# Altium schematic sheet Deneigus_Controle_Soufflante.SchDoc
size Tabloid; Date: Date; Author: Author 1; Revision: 1; Size: 11x17; Sheet_Name: Interface Soufflante
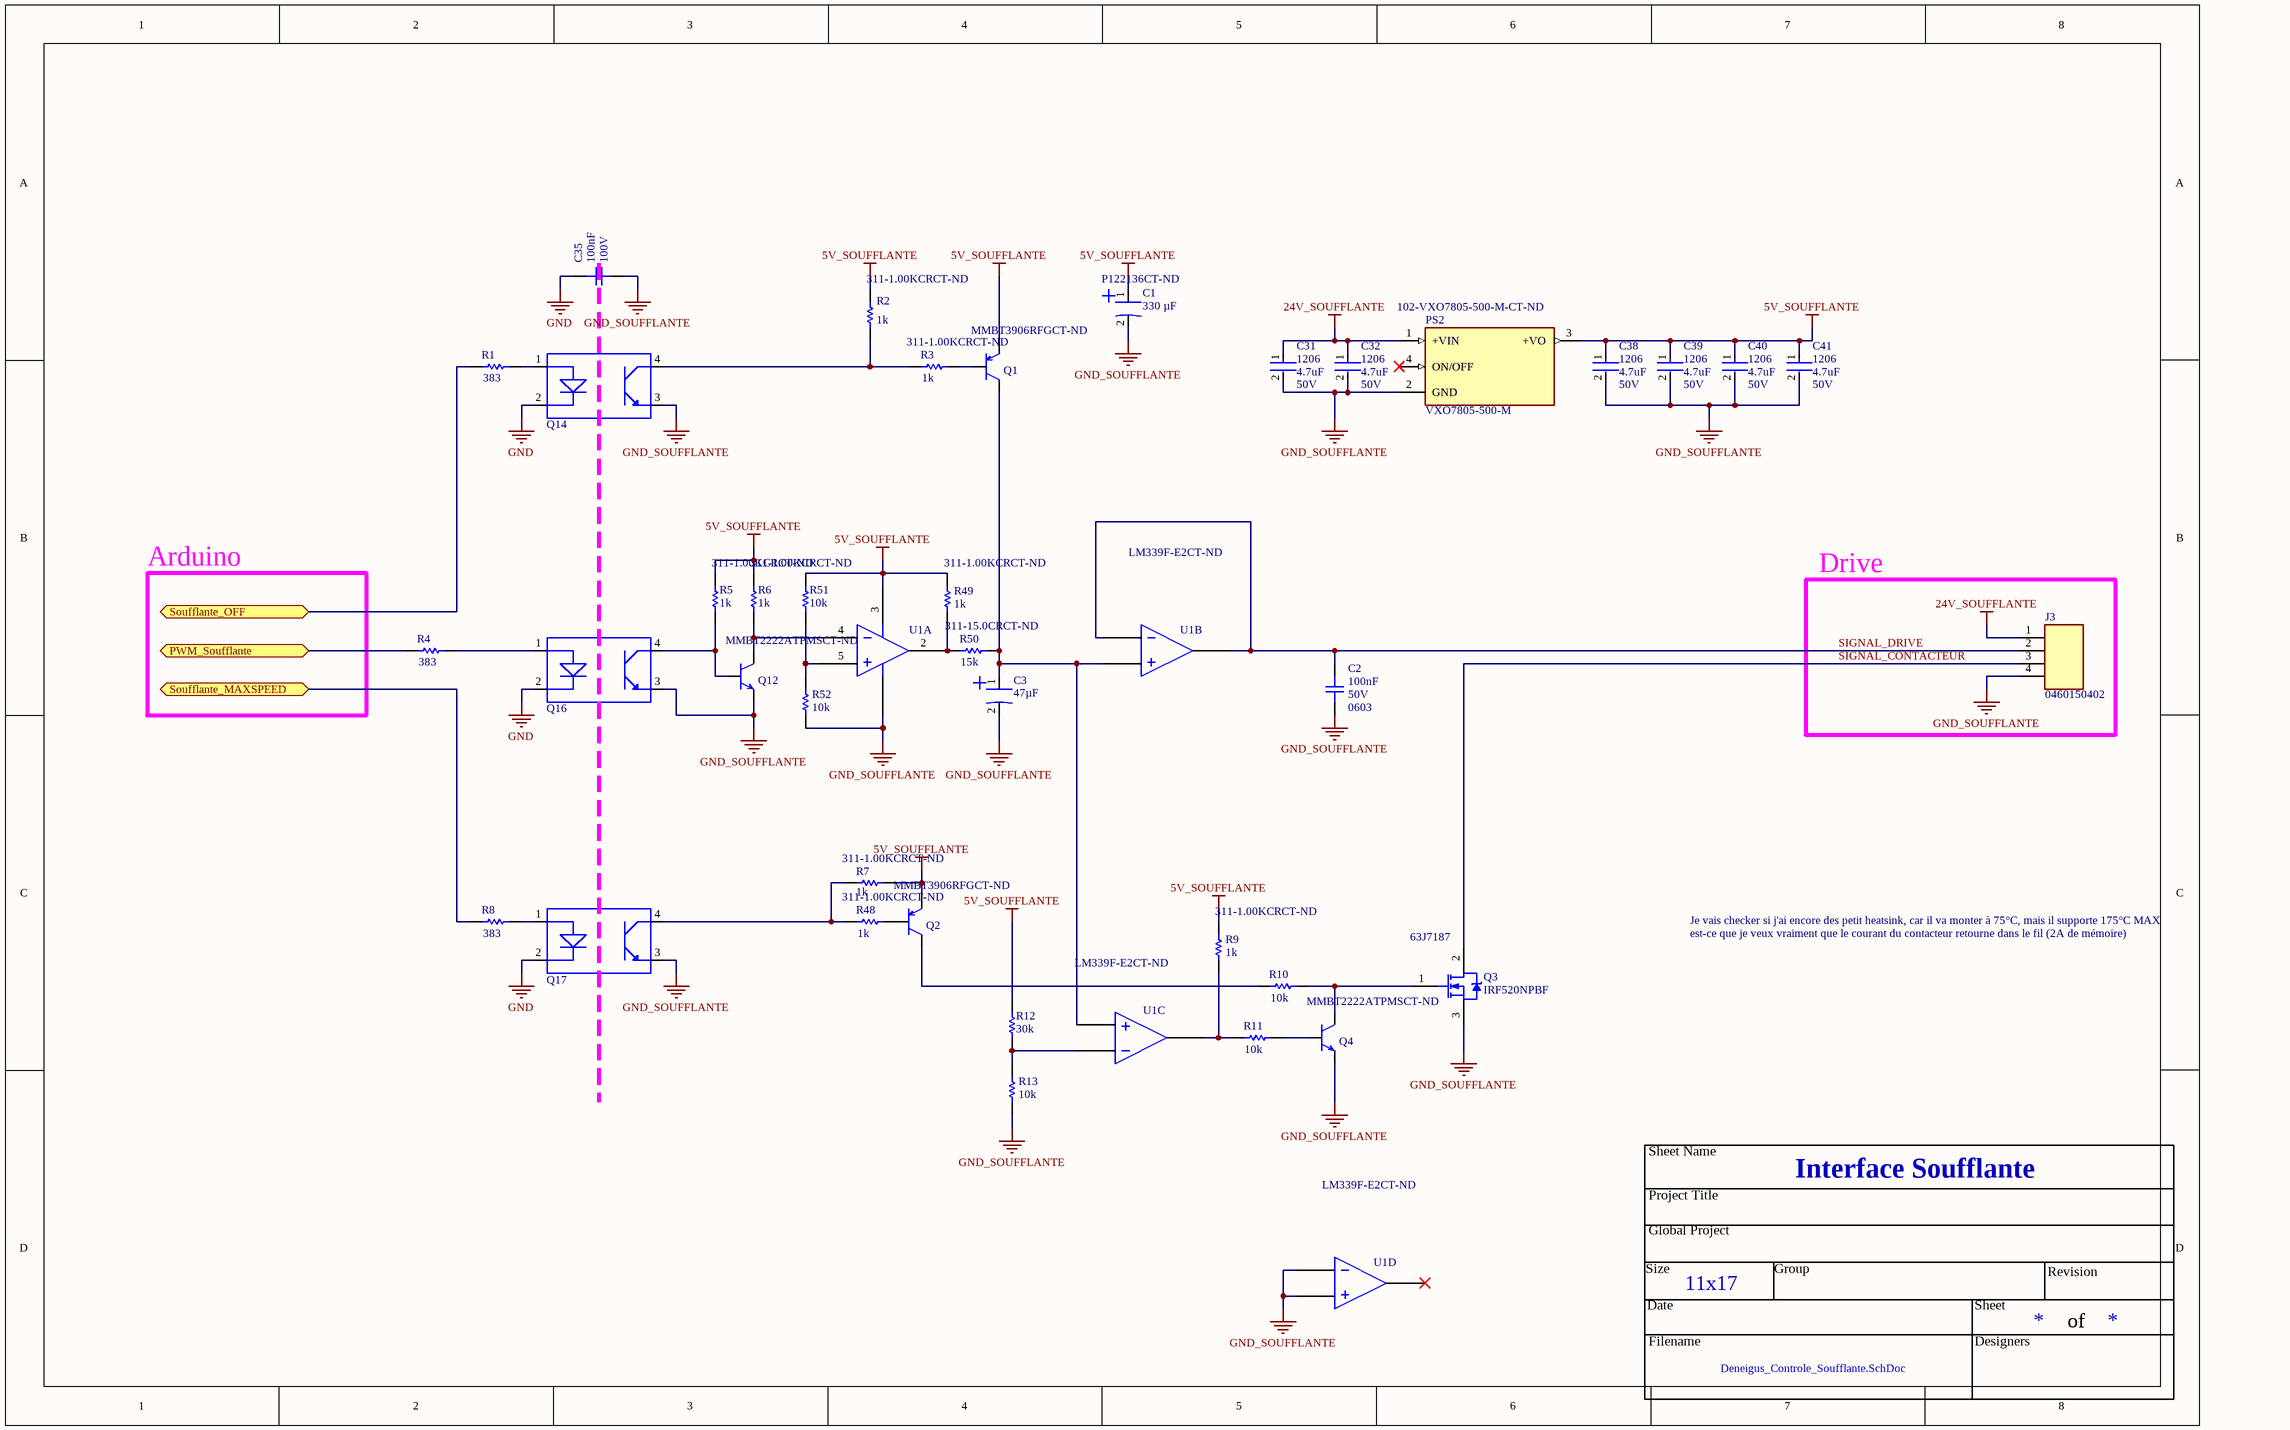
[diagram p0: Deneigus_Controle_Soufflante.SchDoc]

## Parts
C1  value 330 µF  Supplier Part Number 1: P122136CT-ND  [330uF (10.3x10.3mm)]  (hidden comment: CAP ALUM POLY 47UF 20% 16V SMD)
C2  value 100nF  Voltage: 50V  Package: 0603  [CAP_0603]  (hidden comment: CAP - 0603)
C3  value 47µF  [47uF]  (hidden comment: CAP ALUM POLY 47UF 20% 16V SMD)
C31  Case/Package: 1206  Voltage Rating: 50V  Capacitance: 4.7uF  [FP-CL31-IPC_C]  (hidden comment: CL31B475KBHNFNE)
C32  Case/Package: 1206  Voltage Rating: 50V  Capacitance: 4.7uF  [FP-CL31-IPC_C]  (hidden comment: CL31B475KBHNFNE)
C35  value 100nF  Voltage: 100V  [CAP_0805]  (hidden comment: CAP - 0805)
C38  Case/Package: 1206  Voltage Rating: 50V  Capacitance: 4.7uF  [FP-CL31-IPC_C]  (hidden comment: CL31B475KBHNFNE)
C39  Case/Package: 1206  Voltage Rating: 50V  Capacitance: 4.7uF  [FP-CL31-IPC_C]  (hidden comment: CL31B475KBHNFNE)
C40  Case/Package: 1206  Voltage Rating: 50V  Capacitance: 4.7uF  [FP-CL31-IPC_C]  (hidden comment: CL31B475KBHNFNE)
C41  Case/Package: 1206  Voltage Rating: 50V  Capacitance: 4.7uF  [FP-CL31-IPC_C]  (hidden comment: CL31B475KBHNFNE)
J3  0460150402  [Molex_4PIN]
PS2  VXO7805-500-M  Supplier Part Number 1: 102-VXO7805-500-M-CT-ND  [CONV_VXO7805-500-M]
Q1  Supplier Part Number 1: MMBT3906RFGCT-ND  [SOT-23]  (hidden comment: TRANS PNP 40V 0.2A SOT23)
Q2  Supplier Part Number 1: MMBT3906RFGCT-ND  [SOT-23]  (hidden comment: TRANS PNP 40V 0.2A SOT23)
Q3  IRF520NPBF  Supplier Part Number 1: 63J7187  [INTR-TO-220AB-3]
Q4  Supplier Part Number 1: MMBT2222ATPMSCT-ND  [SOT-23]  (hidden comment: TRANS NPN 40V 0.2A SOT23)
Q12  Supplier Part Number 1: MMBT2222ATPMSCT-ND  [SOT-23]  (hidden comment: TRANS NPN 40V 0.2A SOT23)
Q14  WL-OCPT OPTOCOUPLER PHOTOTRANSIS  [WL-OCPT OPTOCOUPLER PHOTOTRANSIS]  (value not drawn)
Q16  WL-OCPT OPTOCOUPLER PHOTOTRANSIS  [WL-OCPT OPTOCOUPLER PHOTOTRANSIS]  (value not drawn)
Q17  WL-OCPT OPTOCOUPLER PHOTOTRANSIS  [WL-OCPT OPTOCOUPLER PHOTOTRANSIS]  (value not drawn)
R1  value 383  [RES_0805]  (hidden comment: Res1)
R2  value 1k  Supplier Part Number 1: 311-1.00KCRCT-ND  [RES_0805]  (hidden comment: Res1)
R3  value 1k  Supplier Part Number 1: 311-1.00KCRCT-ND  [RES_0805]  (hidden comment: Res1)
R4  value 383  [RES_0805]  (hidden comment: Res1)
R5  value 1k  Supplier Part Number 1: 311-1.00KCRCT-ND  [RES_0805]  (hidden comment: Res1)
R6  value 1k  Supplier Part Number 1: 311-1.00KCRCT-ND  [RES_0805]  (hidden comment: Res1)
R7  value 1k  Supplier Part Number 1: 311-1.00KCRCT-ND  [RES_0805]  (hidden comment: Res1)
R8  value 383  [RES_0805]  (hidden comment: Res1)
R9  value 1k  Supplier Part Number 1: 311-1.00KCRCT-ND  [RES_0805]  (hidden comment: Res1)
R10  value 10k  [RES_0805]  (hidden comment: Res1)
R11  value 10k  [RES_0805]  (hidden comment: Res1)
R12  value 30k  [RES_0805]  (hidden comment: Res1)
R13  value 10k  [RES_0805]  (hidden comment: Res1)
R48  value 1k  Supplier Part Number 1: 311-1.00KCRCT-ND  [RES_0805]  (hidden comment: Res1)
R49  value 1k  Supplier Part Number 1: 311-1.00KCRCT-ND  [RES_0805]  (hidden comment: Res1)
R50  value 15k  Supplier Part Number 1: 311-15.0CRCT-ND  [RES_0805]  (hidden comment: Res1)
R51  value 10k  [RES_0805]  (hidden comment: Res1)
R52  value 10k  [RES_0805]  (hidden comment: Res1)
U1  LM339  [SOP14]  (value not drawn)  (parts A,B,C,D of 4)

## Blocks framed on the sheet
Drive: J3

## Ports
PWM_Soufflante (bidir), Soufflante_MAXSPEED (bidir), Soufflante_OFF (bidir)

## Nets
5V_SOUFFLANTE: C1.1 C38.1 C39.1 C40.1 C41.1 PS2.3(+VO) Q1.2 Q2.2 R2.1 R5.2 R6.2 R7.1 R9.2 R12.2 R49.1 R51.2 U1.3
24V_SOUFFLANTE: C31.1 C32.1 J3.1 PS2.1(+VIN)
GND: C35.2 Q14.2 Q16.2 Q17.2
GND_SOUFFLANTE: C1.2 C2.1 C3.2 C31.2 C32.2 C35.1 C38.2 C39.2 C40.2 C41.2 J3.4 PS2.2(GND) Q3.3(S) Q4.2 Q12.2 Q14.3 Q16.3 Q17.3 R13.1 R52.1 U1.10 U1.11 U1.12
PWM_Soufflante: R4.1 ; port PWM_Soufflante
SIGNAL_CONTACTEUR: J3.3 Q3.2(D)
SIGNAL_DRIVE: C2.2 J3.2 U1.1 U1.6
Soufflante_MAXSPEED: R8.1 ; port Soufflante_MAXSPEED
Soufflante_OFF: R1.1 ; port Soufflante_OFF
NetC3_1: C3.1 Q1.3 R50.2 U1.7 U1.9
NetQ1_1: Q1.1 R3.2
NetQ2_1: Q2.1 R48.2
NetQ2_3: Q2.3 R10.2
NetQ3_1: Q3.1(G) Q4.3 R10.1
NetQ4_1: Q4.1 R11.2
NetQ12_1: Q12.1 Q16.4 R5.1
NetQ12_3: Q12.3 R6.1 U1.4
NetQ14_1: Q14.1 R1.2
NetQ14_4: Q14.4 R2.2 R3.1
NetQ16_1: Q16.1 R4.2
NetQ17_1: Q17.1 R8.2
NetQ17_4: Q17.4 R7.2 R48.1
NetR9_1: R9.1 R11.1 U1.14
NetR12_1: R12.1 R13.2 U1.8
NetR49_2: R49.2 R50.1 U1.2
NetR51_1: R51.1 R52.2 U1.5

Not connected (* = marked no-connect by the designer): PS2 4(ON/OFF)*; U1 13*

## Notes on the sheet
- Arduino
- Je vais checker si j'ai encore des petit heatsink, car il va monter à 75°C, mais il supporte 175°C MAX
- est-ce que je veux vraiment que le courant du contacteur retourne dans le fil (2A de mémoire)
- Sheet Name
- Project Title
- Global Project
- Revision
- Size
- Date
- Group
- Sheet
- of
- Filename
- Designers

## Library data of the parts
C1 C3 = 47µF SMD: Mfg Part Number: 875105344006; Mfg: Würth Elektronik; HelpURL: https://www.we-online.de/katalog/datasheet/875105344006.pdf
  C1: Supplier 1: Digi-Key
  C3: Supplier 1: Digikey; Supplier Part Number 1: 732-6421-2-ND
C2 = CAP - 0603: Precision: 10%; Current: *; CreatedBy: Jonathan Bouchard; Power: *
C31 C32 C38-C41 = CMP-13271-001123-1: Cap Ceramic 4.7uF 50V X7R ±10% SMD 1206 +125°C Embossed T/R; Depth: 1.6mm; Max Operating Temperature: 125°C; Case Code (Metric): 3216; Packaging: Tape and Reel; Mount: Surface Mount; Min Operating Temperature: -55°C; Thickness: 0.071inch; Length: 3.2mm; Dielectric: X7R; Case Code (Imperial): 1206; Height: 1.6mm; Package Quantity: 1; Tolerance: 10%; Radiation Hardening: No; Width: 0.063inch
C35 = CAP - 0805: Mfg Part Number: GRM21BR61H106ME43L; Mfg: Murata Electronics; Precision: 10%; Current: *; CreatedBy: Jonathan Bouchard; Power: *; Package: 0805; Supplier 1: Digi-Key; Supplier Part Number 1: 490-5825-1-ND
J3 = Molex_4PIN: Supplier 1: Digi-Key; Supplier Part Number 1: WM3844-ND
PS2 = VXO7805-500-M: 500 mA Output Current, 4.75~36 Vdc Input, SMT, Non-Isolated, Dc-Dc Converter; MF: CUI Inc.; Value: *; Price: None; MP: VXO7805-500-M; SnapEDA_Link: https://www.snapeda.com/parts/VXO7805-500-M/CUI%20Inc./view-part/4703817/?ref=snap; Package: SMD-4; Availability: Unavailable; Supplier 1: Digi-Key
Q1 Q2 = PNP 3906 SMD: Trans GP BJT PNP 40V 0.2A 3-Pin SOT-23 T/R; Manufacturer: MCC; Manufacturer Part Number: MMBT3906-TP; Number of Elements: 1; hFE Min: 60; Max Power Dissipation: 300mW; Frequency: 250MHz; Max Collector Current: 200mA; Emitter Base Voltage (VEBO): 5V; Collector Emitter Saturation Voltage: -250mV; Element Configuration: Single; Current Rating: -2A; Voltage Rating (DC): -40V; Collector-emitter Voltage-Max: 400mV; RoHS: Yes; Category: BJTs; Stock 1: 96763; Pricing 1: 1=0.14000, 10=0.09700, 25=0.09320, 100=0.05250, 500=0.04122, 1000=0.02862 (USD); Mount: Surface Mount; Case/Package: SOT-23; Number of Pins: 3; Min Operating Temperature: -55°C; Max Operating Temperature: 150°C; Package Quantity: 1; Collector Emitter Voltage (VCEO): 40V; Packaging: Tape and Reel; Transition Frequency: 250MHz; Collector Emitter Breakdown Voltage: 40V; Max Breakdown Voltage: 40V; Polarity: PNP; Collector Base Voltage (VCBO): 40V; Power Dissipation: 300mW; Max Frequency: 250MHz; Gain Bandwidth Product: 250MHz; Series: -; Length: 3.04mm; Width: 1.4mm; Height: 1.12mm; Radiation Hardening: No; Lead Free: Lead Free; ComponentLink1URL: https://datasheet.ciiva.com/6362/mmbt3906sot-23-6362513.pdf?src-supplier=Digi-Key; ComponentLink1Description: https://datasheet.ciiva.com/6362/mmbt3906sot-23-6362513.pdf?src-supplier=Digi-Key; ComponentLink2URL: https://datasheet.ciiva.com/15200/getdatasheetpartid-321202-15200524.pdf?src-supplier=Verical; ComponentLink2Description: https://datasheet.ciiva.com/15200/getdatasheetpartid-321202-15200524.pdf?src-supplier=Verical; Supplier 1: Digi-Key
Q3 = CMP-013-00017-4: HEXFET(R) Power MOSFET, 100 V, 9.7 A, 0.2 Ohm, -55 to 175 degC, 3-Pin FM (TO-220AB), RoHS, Tube; Manufacturer: International Rectifier; Manufacturer Part Number: IRF1404PBF; Power: 48W; Elements: 1; Typical Rise Time: 23ns; Nominal Dual Supply Voltage: 100V; Rds On Max: 200mohm; Input Capacitance: 330pF; Nominal Vgs: 4V; Continuous Drain Current (ID): 202A; Gate to Source Voltage (Vgs): 20V; Rise Time: 190ns; Turn-On Delay Time: 17ns; Turn-Off Delay Time: 46ns; Fall Time: 33ns; Power Dissipation: 333W; Drain to Source Breakdown Voltage: 40V; Drain to Source Resistance: 4mR; Recovery Time: 117ns; Element Configuration: Single; Current Rating: 162A; Package Reference: TO-220AB; Max Operating Temperature: 175°C; Datasheet Version: Nov-03; Datasheet URL: http://www.infineon.com/dgdl/irf520npbf.pdf?fileId=5546d462533600a4015355e340711985; Package Quantity: 50; Package Description: 3-Pin Flange Mount, Body 4.445 x 10.415 mm, Pitch 2.54 mm; Pins: 3; Packaging: Rail/Tube; RoHS Compliant: True; Min Operating Temperature: -55°C; Case/Package: TO-220-3; Mounting Technology: TH; Supplier 1: Digikey; RoHS: Yes; Category: MOSFETs; Stock 1: 216; Pricing 1: 1=1.79000, 10=1.54000, 100=1.26000, 500=1.12000, 1000=0.96000 (USD); Mount: Through Hole; Number of Pins: 3; Number of Elements: 1; Max Power Dissipation: 333W; Drain to Source Voltage (Vdss): 40V; Series: HEXFET®; Dual Supply Voltage: 40V; On-State Resistance: 4mR; Termination: Through Hole; Threshold Voltage: 4V; Voltage Rating (DC): 40V; Drain-source On Resistance-Max: 4mR; Length: 10.67mm; Width: 4.83mm; Height: 8.77mm; Lead Pitch: 2.54mm; Radiation Hardening: No; REACH SVHC: No SVHC; Lead Free: Lead Free; ComponentLink1URL: https://datasheet.ciiva.com/7935/irf1404-7935436.pdf?src-supplier=Element14; ComponentLink1Description: https://datasheet.ciiva.com/7935/irf1404-7935436.pdf?src-supplier=Element14; ComponentLink2URL: https://datasheet.ciiva.com/19479/1559551-19479743.pdf?src-supplier=Jameco; ComponentLink2Description: https://datasheet.ciiva.com/19479/1559551-19479743.pdf?src-supplier=Jameco; ComponentLink3URL: https://datasheet.ciiva.com/17323/irf1404pbf-17323123.pdf?src-supplier=Avnet+Europe; ComponentLink3Description: https://datasheet.ciiva.com/17323/irf1404pbf-17323123.pdf?src-supplier=Avnet+Europe; ComponentLink4URL: https://datasheet.ciiva.com/939/irf1404pbf-939787.pdf?src-supplier=Digi-Key; ComponentLink4Description: https://datasheet.ciiva.com/939/irf1404pbf-939787.pdf?src-supplier=Digi-Key; ComponentLink5URL: https://datasheet.ciiva.com/16378/irf1404pbf-16378907.pdf?src-supplier=Future+Electronics; ComponentLink5Description: https://datasheet.ciiva.com/16378/irf1404pbf-16378907.pdf?src-supplier=Future+Electronics
Q4 Q12 = NPN 3904 SMD: Transistor: 200mA 200mW NPN General-Purpose Amplifier, SOT-23, 7IN. Reel; Manufacturer: MCC; Manufacturer Part Number: MMBT3904-TP; Max Power Dissipation: 350mW; Number of Elements: 1; hFE Min: 40; Frequency: 300MHz; Collector Base Voltage (VCBO): 60V; Emitter Base Voltage (VEBO): 6V; Collector Emitter Saturation Voltage: 300mV; Element Configuration: Single; Current Rating: 100mA; RoHS: Yes; Category: BJTs; Stock 1: 949449; Pricing 1: 1=0.10000, 10=0.08100, 25=0.07680, 100=0.04400, 500=0.02706, 1000=0.01844 (USD); Mount: Surface Mount; Case/Package: SOT-23; Number of Pins: 3; Min Operating Temperature: -55°C; Max Operating Temperature: 150°C; Package Quantity: 1; Collector Emitter Voltage (VCEO): 40V; Packaging: Tape and Reel; Max Collector Current: 200mA; Transition Frequency: 300MHz; Collector Emitter Breakdown Voltage: 40V; Polarity: NPN; Max Breakdown Voltage: 40V; Power Dissipation: 350mW; Max Frequency: 300MHz; Gain Bandwidth Product: 300MHz; Voltage Rating (DC): 40V; Series: -; Collector-emitter Voltage-Max: 300mV; Length: 3.04mm; Width: 1.4mm; Height: 1.12mm; Radiation Hardening: No; Lead Free: Lead Free; RoHS Compliant: Yes; ComponentLink1URL: https://datasheet.ciiva.com/972/mmbt3904sot-23-972515.pdf?src-supplier=Digi-Key; ComponentLink1Description: https://datasheet.ciiva.com/972/mmbt3904sot-23-972515.pdf?src-supplier=Digi-Key; ComponentLink2URL: https://datasheet.ciiva.com/16291/mmbt3904sot-23-37005-16291911.pdf?src-supplier=Mouser; ComponentLink2Description: https://datasheet.ciiva.com/16291/mmbt3904sot-23-37005-16291911.pdf?src-supplier=Mouser; ComponentLink3URL: https://datasheet.ciiva.com/15139/getdatasheetpartid-251950-15139820.pdf?src-supplier=Verical; ComponentLink3Description: https://datasheet.ciiva.com/15139/getdatasheetpartid-251950-15139820.pdf?src-supplier=Verical; ComponentLink4URL: https://datasheet.ciiva.com/972/mmbt3904sot-23-972516.pdf?src-supplier=Digi-Key; ComponentLink4Description: https://datasheet.ciiva.com/972/mmbt3904sot-23-972516.pdf?src-supplier=Digi-Key; ComponentLink5URL: https://datasheet.ciiva.com/16742/mmbt3904tsot-523-16742101.pdf?src-supplier=Future+Electronics; ComponentLink5Description: https://datasheet.ciiva.com/16742/mmbt3904tsot-523-16742101.pdf?src-supplier=Future+Electronics; ComponentLink6URL: https://datasheet.ciiva.com/14546/70055699-14546053.pdf?src-supplier=Allied+Electronics; ComponentLink6Description: https://datasheet.ciiva.com/14546/70055699-14546053.pdf?src-supplier=Allied+Electronics; Supplier 1: Digi-Key
Q14 Q16 Q17 = WL-OCPT OPTOCOUPLER PHOTOTRANSIS: Optoisolator Transistor Output 3750Vrms 1 Channel 4-SOP; Supplier 1: Digi-Key; Supplier Part Number 1: 732-140357145400CT-ND
R1-R13 R48-R52 = Res1: Resistor; Published: 8-Jun-2000; LatestRevisionDate: 17-Jul-2002; LatestRevisionNote: Re-released for DXP Platform.; PackageReference: AXIAL-0.3; Publisher: Altium Limited; PackageDescription: Axial Device, Thru-Hole; 2 Leads; 0.3 in Pin Spacing
  R2 R3 R5-R7 R9 R48-R50: Supplier 1: Digi-Key
U1 = LM339: Comparator Quad ±16V/32V 14-Pin SOP T/R; Mfg Part Number: LM339F-E2; Manufacturer: Rohm; Voltage: 1.14 V ~ 1.26 V; Mfg: Rohm Semiconductor; Current: *; Power: *; HelpURL: https://d1d2qsbl8m0m72.cloudfront.net/en/products/databook/datasheet/ic/amp_linear/comparator/lm393f-e.pdf; CreatedBy: Samuel Mathieu; Temperature: -40°C ~ 85°C; Value: *; Precision: *; Package: BGA-676; Supplier 1: Digikey; Supplier Part Number 1: LM339F-E2TR-ND; Supplier 2: Digi-Key; Manufacturer Part Number: LM339F-E2; RoHS: Yes; Category: Comparators; Stock 2: 2211; Pricing 2: 1=0.96000, 10=0.84900, 25=0.79720, 100=0.65060, 250=0.60432, 500=0.51432, 1000=0.41145 (USD); RoHS Compliant: Yes; Supplier Part Number 2: LM339F-E2CT-ND